# Altium schematic sheet 4_wiring drawing.SchDoc: DUT POWER ON/OFF CONTROL
size A2; ApprovedBy: Approved By; CheckedBy: Sky Ma; DrawnBy: Jack; Address1: 1; Address2: 2; Address3: 3; Address4: 4; DocumentNumber: 04-TE-42-4015-0PA-A; Revision: A; SheetNumber: 5; SheetTotal: 6; SheetSize: A2; CheckedByDate: 2022-11-19; DrawByDate: 2022-11-19; SiteName: EMS TD Huangpu; ProjectName: 19205_BMW CCU DDR PCBA FT fixture wiring
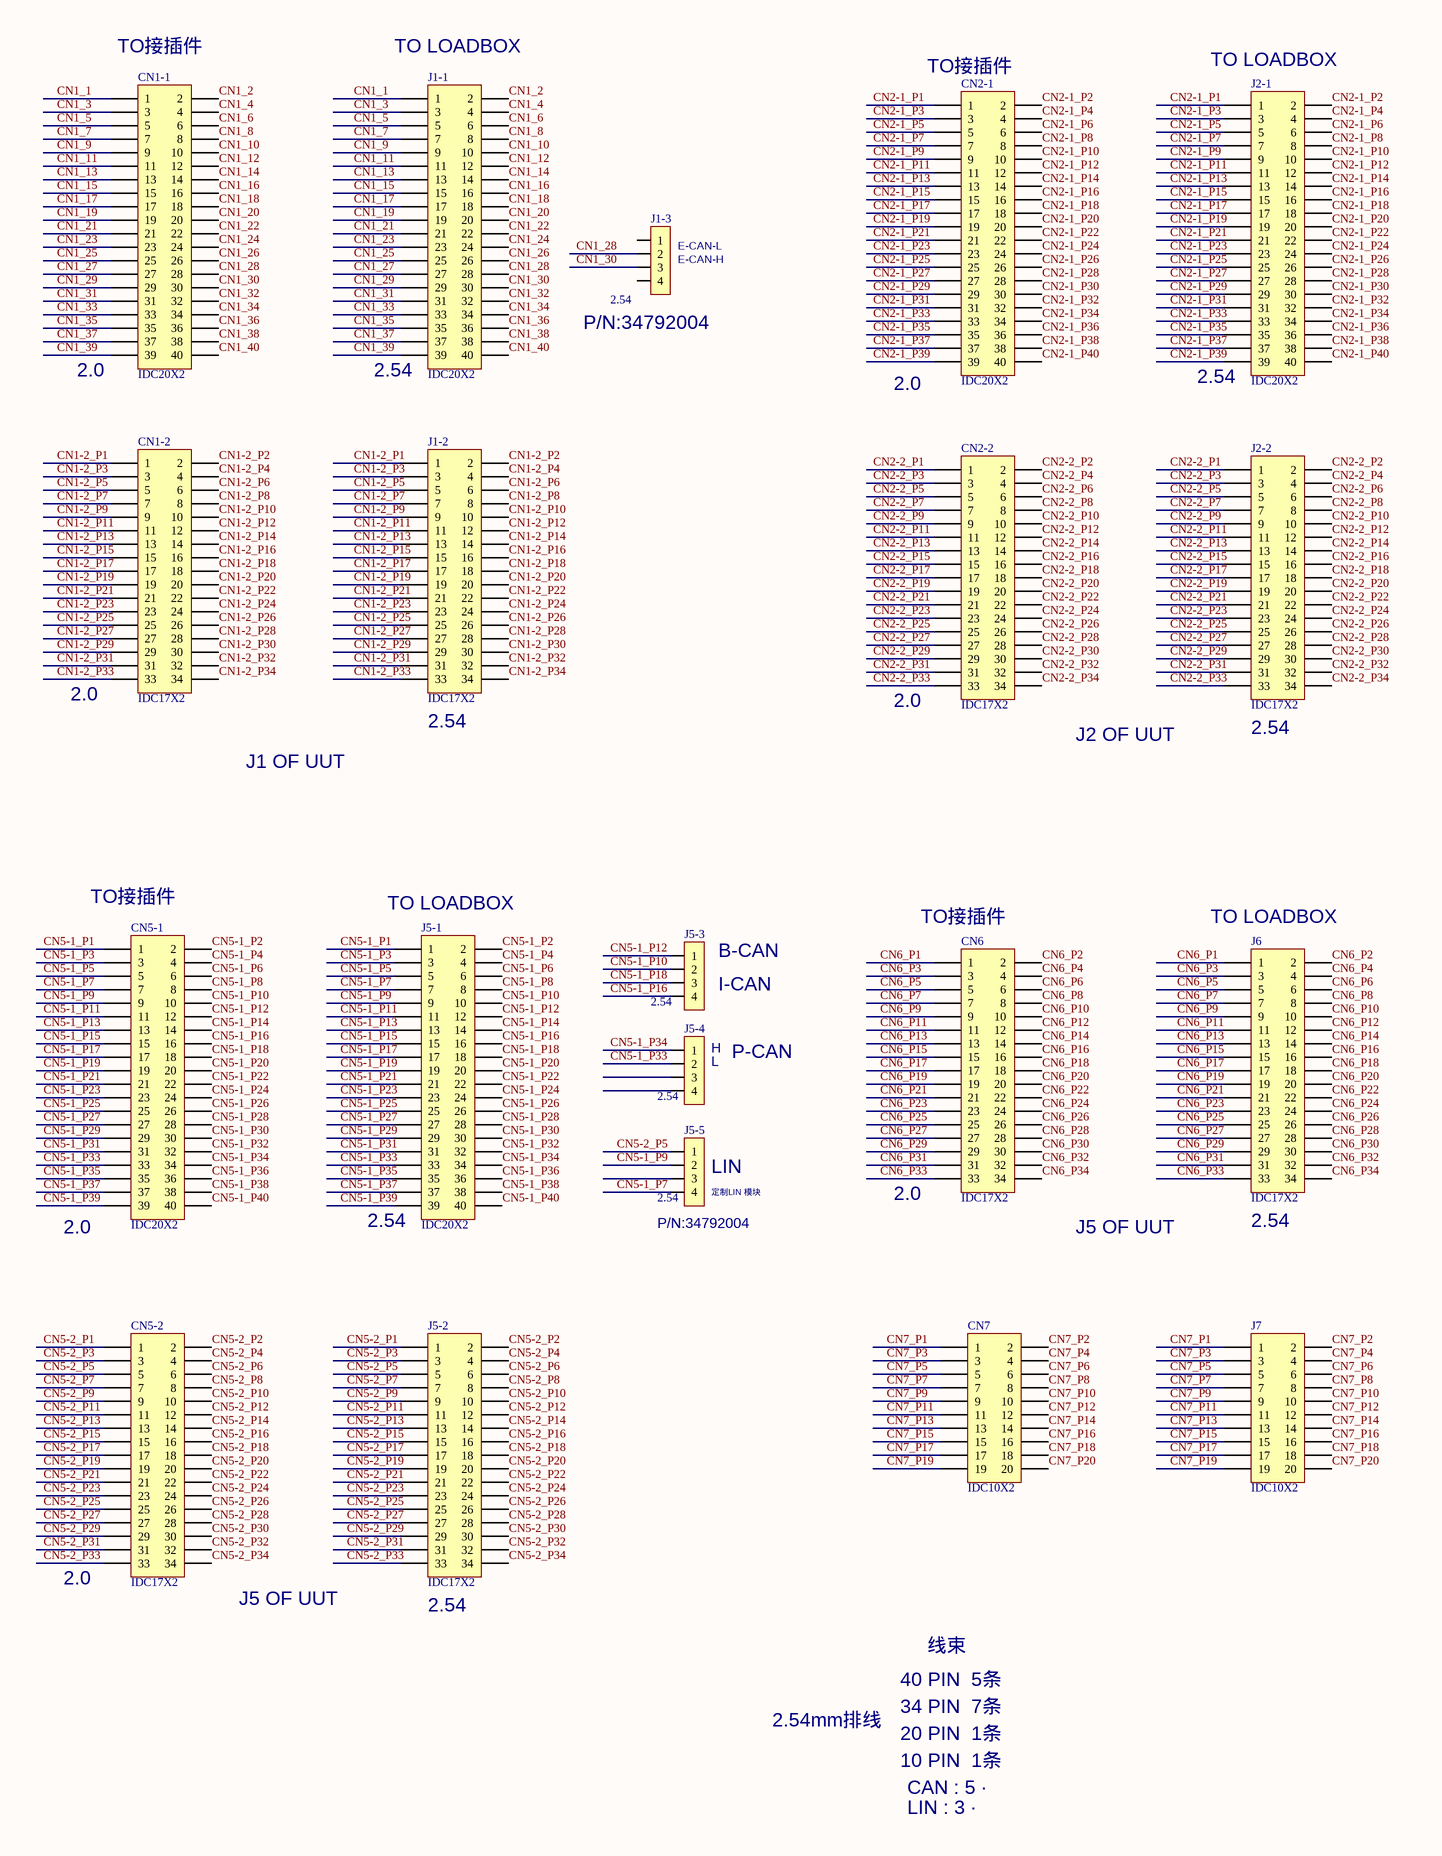
[diagram p0: 4_wiring drawing.SchDoc, left]
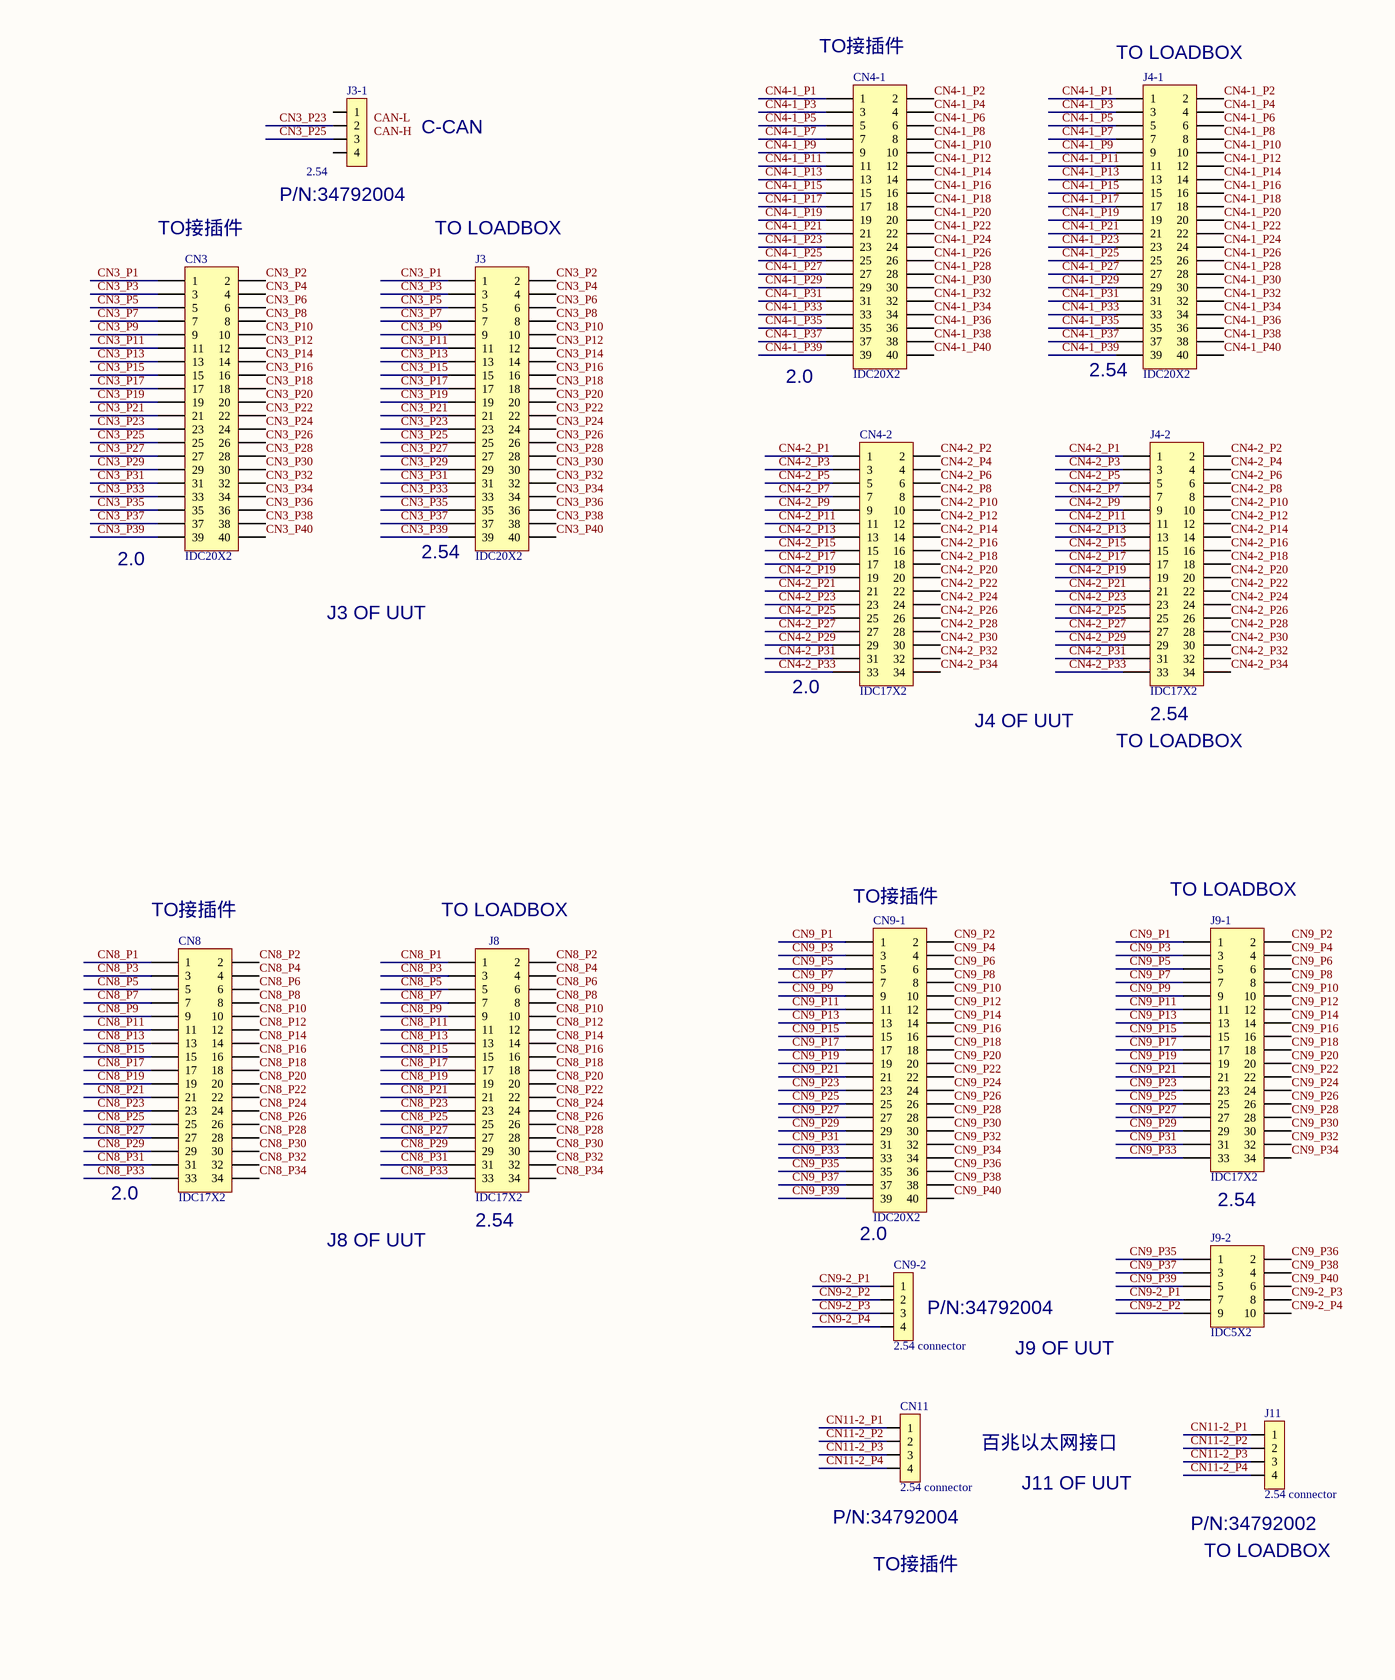
[diagram p1: 4_wiring drawing.SchDoc, right]

## Parts
CN1-1  IDC20X2  [IDC40]
CN1-2  IDC17X2  [IDC34]
CN2-1  IDC20X2  [IDC40]
CN2-2  IDC17X2  [IDC34]
CN3  IDC20X2  [IDC40]
CN4-1  IDC20X2  [IDC40]
CN4-2  IDC17X2  [IDC34]
CN5-1  IDC20X2  [IDC40]
CN5-2  IDC17X2  [IDC34]
CN6  IDC17X2  [IDC34]
CN7  IDC10X2  [IDC20]
CN8  IDC17X2  [IDC34]
CN9-1  IDC20X2  [IDC40]
CN9-2  2.54 connector  [2.54mm-4]
CN11  2.54 connector  [2.54mm-4]
J1-1  IDC20X2  [IDC40]
J1-2  IDC17X2  [IDC34]
J1-3  2.54  [2.54mm-4]
J2-1  IDC20X2  [IDC40]
J2-2  IDC17X2  [IDC34]
J3  IDC20X2  [IDC40]
J3-1  2.54  [2.54mm-4]
J4-1  IDC20X2  [IDC40]
J4-2  IDC17X2  [IDC34]
J5-1  IDC20X2  [IDC40]
J5-2  IDC17X2  [IDC34]
J5-3  2.54  [2.54mm-4]
J5-4  2.54  [2.54mm-4]
J5-5  2.54  [2.54mm-4]
J6  IDC17X2  [IDC34]
J7  IDC10X2  [IDC20]
J8  IDC17X2  [IDC34]
J9-1  IDC17X2  [IDC34]
J9-2  IDC5X2  [IDC10]
J11  2.54 connector  [2.54mm-4]

## Nets
CN1-2_P1: CN1-2.1 J1-2.1
CN1-2_P2: CN1-2.2 J1-2.2
CN1-2_P3: CN1-2.3 J1-2.3
CN1-2_P4: CN1-2.4 J1-2.4
CN1-2_P5: CN1-2.5 J1-2.5
CN1-2_P6: CN1-2.6 J1-2.6
CN1-2_P7: CN1-2.7 J1-2.7
CN1-2_P8: CN1-2.8 J1-2.8
CN1-2_P9: CN1-2.9 J1-2.9
CN1-2_P10: CN1-2.10 J1-2.10
CN1-2_P11: CN1-2.11 J1-2.11
CN1-2_P12: CN1-2.12 J1-2.12
CN1-2_P13: CN1-2.13 J1-2.13
CN1-2_P14: CN1-2.14 J1-2.14
CN1-2_P15: CN1-2.15 J1-2.15
CN1-2_P16: CN1-2.16 J1-2.16
CN1-2_P17: CN1-2.17 J1-2.17
CN1-2_P18: CN1-2.18 J1-2.18
CN1-2_P19: CN1-2.19 J1-2.19
CN1-2_P20: CN1-2.20 J1-2.20
CN1-2_P21: CN1-2.21 J1-2.21
CN1-2_P22: CN1-2.22 J1-2.22
CN1-2_P23: CN1-2.23 J1-2.23
CN1-2_P24: CN1-2.24 J1-2.24
CN1-2_P25: CN1-2.25 J1-2.25
CN1-2_P26: CN1-2.26 J1-2.26
CN1-2_P27: CN1-2.27 J1-2.27
CN1-2_P28: CN1-2.28 J1-2.28
CN1-2_P29: CN1-2.29 J1-2.29
CN1-2_P30: CN1-2.30 J1-2.30
CN1-2_P31: CN1-2.31 J1-2.31
CN1-2_P32: CN1-2.32 J1-2.32
CN1-2_P33: CN1-2.33 J1-2.33
CN1-2_P34: CN1-2.34 J1-2.34
CN1_1: CN1-1.1 J1-1.1
CN1_2: CN1-1.2 J1-1.2
CN1_3: CN1-1.3 J1-1.3
CN1_4: CN1-1.4 J1-1.4
CN1_5: CN1-1.5 J1-1.5
CN1_6: CN1-1.6 J1-1.6
CN1_7: CN1-1.7 J1-1.7
CN1_8: CN1-1.8 J1-1.8
CN1_9: CN1-1.9 J1-1.9
CN1_10: CN1-1.10 J1-1.10
CN1_11: CN1-1.11 J1-1.11
CN1_12: CN1-1.12 J1-1.12
CN1_13: CN1-1.13 J1-1.13
CN1_14: CN1-1.14 J1-1.14
CN1_15: CN1-1.15 J1-1.15
CN1_16: CN1-1.16 J1-1.16
CN1_17: CN1-1.17 J1-1.17
CN1_18: CN1-1.18 J1-1.18
CN1_19: CN1-1.19 J1-1.19
CN1_20: CN1-1.20 J1-1.20
CN1_21: CN1-1.21 J1-1.21
CN1_22: CN1-1.22 J1-1.22
CN1_23: CN1-1.23 J1-1.23
CN1_24: CN1-1.24 J1-1.24
CN1_25: CN1-1.25 J1-1.25
CN1_26: CN1-1.26 J1-1.26
CN1_27: CN1-1.27 J1-1.27
CN1_28: CN1-1.28 J1-1.28 J1-3.2
CN1_29: CN1-1.29 J1-1.29
CN1_30: CN1-1.30 J1-1.30 J1-3.3
CN1_31: CN1-1.31 J1-1.31
CN1_32: CN1-1.32 J1-1.32
CN1_33: CN1-1.33 J1-1.33
CN1_34: CN1-1.34 J1-1.34
CN1_35: CN1-1.35 J1-1.35
CN1_36: CN1-1.36 J1-1.36
CN1_37: CN1-1.37 J1-1.37
CN1_38: CN1-1.38 J1-1.38
CN1_39: CN1-1.39 J1-1.39
CN1_40: CN1-1.40 J1-1.40
CN2-1_P1: CN2-1.1 J2-1.1
CN2-1_P2: CN2-1.2 J2-1.2
CN2-1_P3: CN2-1.3 J2-1.3
CN2-1_P4: CN2-1.4 J2-1.4
CN2-1_P5: CN2-1.5 J2-1.5
CN2-1_P6: CN2-1.6 J2-1.6
CN2-1_P7: CN2-1.7 J2-1.7
CN2-1_P8: CN2-1.8 J2-1.8
CN2-1_P9: CN2-1.9 J2-1.9
CN2-1_P10: CN2-1.10 J2-1.10
CN2-1_P11: CN2-1.11 J2-1.11
CN2-1_P12: CN2-1.12 J2-1.12
CN2-1_P13: CN2-1.13 J2-1.13
CN2-1_P14: CN2-1.14 J2-1.14
CN2-1_P15: CN2-1.15 J2-1.15
CN2-1_P16: CN2-1.16 J2-1.16
CN2-1_P17: CN2-1.17 J2-1.17
CN2-1_P18: CN2-1.18 J2-1.18
CN2-1_P19: CN2-1.19 J2-1.19
CN2-1_P20: CN2-1.20 J2-1.20
CN2-1_P21: CN2-1.21 J2-1.21
CN2-1_P22: CN2-1.22 J2-1.22
CN2-1_P23: CN2-1.23 J2-1.23
CN2-1_P24: CN2-1.24 J2-1.24
CN2-1_P25: CN2-1.25 J2-1.25
CN2-1_P26: CN2-1.26 J2-1.26
CN2-1_P27: CN2-1.27 J2-1.27
CN2-1_P28: CN2-1.28 J2-1.28
CN2-1_P29: CN2-1.29 J2-1.29
CN2-1_P30: CN2-1.30 J2-1.30
CN2-1_P31: CN2-1.31 J2-1.31
CN2-1_P32: CN2-1.32 J2-1.32
CN2-1_P33: CN2-1.33 J2-1.33
CN2-1_P34: CN2-1.34 J2-1.34
CN2-1_P35: CN2-1.35 J2-1.35
CN2-1_P36: CN2-1.36 J2-1.36
CN2-1_P37: CN2-1.37 J2-1.37
CN2-1_P38: CN2-1.38 J2-1.38
CN2-1_P39: CN2-1.39 J2-1.39
CN2-1_P40: CN2-1.40 J2-1.40
CN2-2_P1: CN2-2.1 J2-2.1
CN2-2_P2: CN2-2.2 J2-2.2
CN2-2_P3: CN2-2.3 J2-2.3
CN2-2_P4: CN2-2.4 J2-2.4
CN2-2_P5: CN2-2.5 J2-2.5
CN2-2_P6: CN2-2.6 J2-2.6
CN2-2_P7: CN2-2.7 J2-2.7
CN2-2_P8: CN2-2.8 J2-2.8
CN2-2_P9: CN2-2.9 J2-2.9
CN2-2_P10: CN2-2.10 J2-2.10
CN2-2_P11: CN2-2.11 J2-2.11
CN2-2_P12: CN2-2.12 J2-2.12
CN2-2_P13: CN2-2.13 J2-2.13
CN2-2_P14: CN2-2.14 J2-2.14
CN2-2_P15: CN2-2.15 J2-2.15
CN2-2_P16: CN2-2.16 J2-2.16
CN2-2_P17: CN2-2.17 J2-2.17
CN2-2_P18: CN2-2.18 J2-2.18
CN2-2_P19: CN2-2.19 J2-2.19
CN2-2_P20: CN2-2.20 J2-2.20
CN2-2_P21: CN2-2.21 J2-2.21
CN2-2_P22: CN2-2.22 J2-2.22
CN2-2_P23: CN2-2.23 J2-2.23
CN2-2_P24: CN2-2.24 J2-2.24
CN2-2_P25: CN2-2.25 J2-2.25
CN2-2_P26: CN2-2.26 J2-2.26
CN2-2_P27: CN2-2.27 J2-2.27
CN2-2_P28: CN2-2.28 J2-2.28
CN2-2_P29: CN2-2.29 J2-2.29
CN2-2_P30: CN2-2.30 J2-2.30
CN2-2_P31: CN2-2.31 J2-2.31
CN2-2_P32: CN2-2.32 J2-2.32
CN2-2_P33: CN2-2.33 J2-2.33
CN2-2_P34: CN2-2.34 J2-2.34
CN3_P1: CN3.1 J3.1
CN3_P2: CN3.2 J3.2
CN3_P3: CN3.3 J3.3
CN3_P4: CN3.4 J3.4
CN3_P5: CN3.5 J3.5
CN3_P6: CN3.6 J3.6
CN3_P7: CN3.7 J3.7
CN3_P8: CN3.8 J3.8
CN3_P9: CN3.9 J3.9
CN3_P10: CN3.10 J3.10
CN3_P11: CN3.11 J3.11
CN3_P12: CN3.12 J3.12
CN3_P13: CN3.13 J3.13
CN3_P14: CN3.14 J3.14
CN3_P15: CN3.15 J3.15
CN3_P16: CN3.16 J3.16
CN3_P17: CN3.17 J3.17
CN3_P18: CN3.18 J3.18
CN3_P19: CN3.19 J3.19
CN3_P20: CN3.20 J3.20
CN3_P21: CN3.21 J3.21
CN3_P22: CN3.22 J3.22
CN3_P23: CN3.23 J3.23 J3-1.2
CN3_P24: CN3.24 J3.24
CN3_P25: CN3.25 J3.25 J3-1.3
CN3_P26: CN3.26 J3.26
CN3_P27: CN3.27 J3.27
CN3_P28: CN3.28 J3.28
CN3_P29: CN3.29 J3.29
CN3_P30: CN3.30 J3.30
CN3_P31: CN3.31 J3.31
CN3_P32: CN3.32 J3.32
CN3_P33: CN3.33 J3.33
CN3_P34: CN3.34 J3.34
CN3_P35: CN3.35 J3.35
CN3_P36: CN3.36 J3.36
CN3_P37: CN3.37 J3.37
CN3_P38: CN3.38 J3.38
CN3_P39: CN3.39 J3.39
CN3_P40: CN3.40 J3.40
CN4-1_P1: CN4-1.1 J4-1.1
CN4-1_P2: CN4-1.2 J4-1.2
CN4-1_P3: CN4-1.3 J4-1.3
CN4-1_P4: CN4-1.4 J4-1.4
CN4-1_P5: CN4-1.5 J4-1.5
CN4-1_P6: CN4-1.6 J4-1.6
CN4-1_P7: CN4-1.7 J4-1.7
CN4-1_P8: CN4-1.8 J4-1.8
CN4-1_P9: CN4-1.9 J4-1.9
CN4-1_P10: CN4-1.10 J4-1.10
CN4-1_P11: CN4-1.11 J4-1.11
CN4-1_P12: CN4-1.12 J4-1.12
CN4-1_P13: CN4-1.13 J4-1.13
CN4-1_P14: CN4-1.14 J4-1.14
CN4-1_P15: CN4-1.15 J4-1.15
CN4-1_P16: CN4-1.16 J4-1.16
CN4-1_P17: CN4-1.17 J4-1.17
CN4-1_P18: CN4-1.18 J4-1.18
CN4-1_P19: CN4-1.19 J4-1.19
CN4-1_P20: CN4-1.20 J4-1.20
CN4-1_P21: CN4-1.21 J4-1.21
CN4-1_P22: CN4-1.22 J4-1.22
CN4-1_P23: CN4-1.23 J4-1.23
CN4-1_P24: CN4-1.24 J4-1.24
CN4-1_P25: CN4-1.25 J4-1.25
CN4-1_P26: CN4-1.26 J4-1.26
CN4-1_P27: CN4-1.27 J4-1.27
CN4-1_P28: CN4-1.28 J4-1.28
CN4-1_P29: CN4-1.29 J4-1.29
CN4-1_P30: CN4-1.30 J4-1.30
CN4-1_P31: CN4-1.31 J4-1.31
CN4-1_P32: CN4-1.32 J4-1.32
CN4-1_P33: CN4-1.33 J4-1.33
CN4-1_P34: CN4-1.34 J4-1.34
CN4-1_P35: CN4-1.35 J4-1.35
CN4-1_P36: CN4-1.36 J4-1.36
CN4-1_P37: CN4-1.37 J4-1.37
CN4-1_P38: CN4-1.38 J4-1.38
CN4-1_P39: CN4-1.39 J4-1.39
CN4-1_P40: CN4-1.40 J4-1.40
CN4-2_P1: CN4-2.1 J4-2.1
CN4-2_P2: CN4-2.2 J4-2.2
CN4-2_P3: CN4-2.3 J4-2.3
CN4-2_P4: CN4-2.4 J4-2.4
CN4-2_P5: CN4-2.5 J4-2.5
CN4-2_P6: CN4-2.6 J4-2.6
CN4-2_P7: CN4-2.7 J4-2.7
CN4-2_P8: CN4-2.8 J4-2.8
CN4-2_P9: CN4-2.9 J4-2.9
CN4-2_P10: CN4-2.10 J4-2.10
CN4-2_P11: CN4-2.11 J4-2.11
CN4-2_P12: CN4-2.12 J4-2.12
CN4-2_P13: CN4-2.13 J4-2.13
CN4-2_P14: CN4-2.14 J4-2.14
CN4-2_P15: CN4-2.15 J4-2.15
CN4-2_P16: CN4-2.16 J4-2.16
CN4-2_P17: CN4-2.17 J4-2.17
CN4-2_P18: CN4-2.18 J4-2.18
CN4-2_P19: CN4-2.19 J4-2.19
CN4-2_P20: CN4-2.20 J4-2.20
CN4-2_P21: CN4-2.21 J4-2.21
CN4-2_P22: CN4-2.22 J4-2.22
CN4-2_P23: CN4-2.23 J4-2.23
CN4-2_P24: CN4-2.24 J4-2.24
CN4-2_P25: CN4-2.25 J4-2.25
CN4-2_P26: CN4-2.26 J4-2.26
CN4-2_P27: CN4-2.27 J4-2.27
CN4-2_P28: CN4-2.28 J4-2.28
CN4-2_P29: CN4-2.29 J4-2.29
CN4-2_P30: CN4-2.30 J4-2.30
CN4-2_P31: CN4-2.31 J4-2.31
CN4-2_P32: CN4-2.32 J4-2.32
CN4-2_P33: CN4-2.33 J4-2.33
CN4-2_P34: CN4-2.34 J4-2.34
CN5-1_P1: CN5-1.1 J5-1.1
CN5-1_P2: CN5-1.2 J5-1.2
CN5-1_P3: CN5-1.3 J5-1.3
CN5-1_P4: CN5-1.4 J5-1.4
CN5-1_P5: CN5-1.5 J5-1.5
CN5-1_P6: CN5-1.6 J5-1.6
CN5-1_P7: CN5-1.7 J5-1.7 J5-5.4
CN5-1_P8: CN5-1.8 J5-1.8
CN5-1_P9: CN5-1.9 J5-1.9 J5-5.2
CN5-1_P10: CN5-1.10 J5-1.10 J5-3.2
CN5-1_P11: CN5-1.11 J5-1.11
CN5-1_P12: CN5-1.12 J5-1.12 J5-3.1
CN5-1_P13: CN5-1.13 J5-1.13
CN5-1_P14: CN5-1.14 J5-1.14
CN5-1_P15: CN5-1.15 J5-1.15
CN5-1_P16: CN5-1.16 J5-1.16 J5-3.4
CN5-1_P17: CN5-1.17 J5-1.17
CN5-1_P18: CN5-1.18 J5-1.18 J5-3.3
CN5-1_P19: CN5-1.19 J5-1.19
CN5-1_P20: CN5-1.20 J5-1.20
CN5-1_P21: CN5-1.21 J5-1.21
CN5-1_P22: CN5-1.22 J5-1.22
CN5-1_P23: CN5-1.23 J5-1.23
CN5-1_P24: CN5-1.24 J5-1.24
CN5-1_P25: CN5-1.25 J5-1.25
CN5-1_P26: CN5-1.26 J5-1.26
CN5-1_P27: CN5-1.27 J5-1.27
CN5-1_P28: CN5-1.28 J5-1.28
CN5-1_P29: CN5-1.29 J5-1.29
CN5-1_P30: CN5-1.30 J5-1.30
CN5-1_P31: CN5-1.31 J5-1.31
CN5-1_P32: CN5-1.32 J5-1.32
CN5-1_P33: CN5-1.33 J5-1.33 J5-4.2
CN5-1_P34: CN5-1.34 J5-1.34 J5-4.1
CN5-1_P35: CN5-1.35 J5-1.35
CN5-1_P36: CN5-1.36 J5-1.36
CN5-1_P37: CN5-1.37 J5-1.37
CN5-1_P38: CN5-1.38 J5-1.38
CN5-1_P39: CN5-1.39 J5-1.39
CN5-1_P40: CN5-1.40 J5-1.40
CN5-2_P1: CN5-2.1 J5-2.1
CN5-2_P2: CN5-2.2 J5-2.2
CN5-2_P3: CN5-2.3 J5-2.3
CN5-2_P4: CN5-2.4 J5-2.4
CN5-2_P5: CN5-2.5 J5-2.5 J5-5.1
CN5-2_P6: CN5-2.6 J5-2.6
CN5-2_P7: CN5-2.7 J5-2.7
CN5-2_P8: CN5-2.8 J5-2.8
CN5-2_P9: CN5-2.9 J5-2.9
CN5-2_P10: CN5-2.10 J5-2.10
CN5-2_P11: CN5-2.11 J5-2.11
CN5-2_P12: CN5-2.12 J5-2.12
CN5-2_P13: CN5-2.13 J5-2.13
CN5-2_P14: CN5-2.14 J5-2.14
CN5-2_P15: CN5-2.15 J5-2.15
CN5-2_P16: CN5-2.16 J5-2.16
CN5-2_P17: CN5-2.17 J5-2.17
CN5-2_P18: CN5-2.18 J5-2.18
CN5-2_P19: CN5-2.19 J5-2.19
CN5-2_P20: CN5-2.20 J5-2.20
CN5-2_P21: CN5-2.21 J5-2.21
CN5-2_P22: CN5-2.22 J5-2.22
CN5-2_P23: CN5-2.23 J5-2.23
CN5-2_P24: CN5-2.24 J5-2.24
CN5-2_P25: CN5-2.25 J5-2.25
CN5-2_P26: CN5-2.26 J5-2.26
CN5-2_P27: CN5-2.27 J5-2.27
CN5-2_P28: CN5-2.28 J5-2.28
CN5-2_P29: CN5-2.29 J5-2.29
CN5-2_P30: CN5-2.30 J5-2.30
CN5-2_P31: CN5-2.31 J5-2.31
CN5-2_P32: CN5-2.32 J5-2.32
CN5-2_P33: CN5-2.33 J5-2.33
CN5-2_P34: CN5-2.34 J5-2.34
CN6_P1: CN6.1 J6.1
CN6_P2: CN6.2 J6.2
CN6_P3: CN6.3 J6.3
CN6_P4: CN6.4 J6.4
CN6_P5: CN6.5 J6.5
CN6_P6: CN6.6 J6.6
CN6_P7: CN6.7 J6.7
CN6_P8: CN6.8 J6.8
CN6_P9: CN6.9 J6.9
CN6_P10: CN6.10 J6.10
CN6_P11: CN6.11 J6.11
CN6_P12: CN6.12 J6.12
CN6_P13: CN6.13 J6.13
CN6_P14: CN6.14 J6.14
CN6_P15: CN6.15 J6.15
CN6_P16: CN6.16 J6.16
CN6_P17: CN6.17 J6.17
CN6_P18: CN6.18 J6.18
CN6_P19: CN6.19 J6.19
CN6_P20: CN6.20 J6.20
CN6_P21: CN6.21 J6.21
CN6_P22: CN6.22 J6.22
CN6_P23: CN6.23 J6.23
CN6_P24: CN6.24 J6.24
CN6_P25: CN6.25 J6.25
CN6_P26: CN6.26 J6.26
CN6_P27: CN6.27 J6.27
CN6_P28: CN6.28 J6.28
CN6_P29: CN6.29 J6.29
CN6_P30: CN6.30 J6.30
CN6_P31: CN6.31 J6.31
CN6_P32: CN6.32 J6.32
CN6_P33: CN6.33 J6.33
CN6_P34: CN6.34 J6.34
CN7_P1: CN7.1 J7.1
CN7_P2: CN7.2 J7.2
CN7_P3: CN7.3 J7.3
CN7_P4: CN7.4 J7.4
CN7_P5: CN7.5 J7.5
CN7_P6: CN7.6 J7.6
CN7_P7: CN7.7 J7.7
CN7_P8: CN7.8 J7.8
CN7_P9: CN7.9 J7.9
CN7_P10: CN7.10 J7.10
CN7_P11: CN7.11 J7.11
CN7_P12: CN7.12 J7.12
CN7_P13: CN7.13 J7.13
CN7_P14: CN7.14 J7.14
CN7_P15: CN7.15 J7.15
CN7_P16: CN7.16 J7.16
CN7_P17: CN7.17 J7.17
CN7_P18: CN7.18 J7.18
CN7_P19: CN7.19 J7.19
CN7_P20: CN7.20 J7.20
CN8_P1: CN8.1 J8.1
CN8_P2: CN8.2 J8.2
CN8_P3: CN8.3 J8.3
CN8_P4: CN8.4 J8.4
CN8_P5: CN8.5 J8.5
CN8_P6: CN8.6 J8.6
CN8_P7: CN8.7 J8.7
CN8_P8: CN8.8 J8.8
CN8_P9: CN8.9 J8.9
CN8_P10: CN8.10 J8.10
CN8_P11: CN8.11 J8.11
CN8_P12: CN8.12 J8.12
CN8_P13: CN8.13 J8.13
CN8_P14: CN8.14 J8.14
CN8_P15: CN8.15 J8.15
CN8_P16: CN8.16 J8.16
CN8_P17: CN8.17 J8.17
CN8_P18: CN8.18 J8.18
CN8_P19: CN8.19 J8.19
CN8_P20: CN8.20 J8.20
CN8_P21: CN8.21 J8.21
CN8_P22: CN8.22 J8.22
CN8_P23: CN8.23 J8.23
CN8_P24: CN8.24 J8.24
CN8_P25: CN8.25 J8.25
CN8_P26: CN8.26 J8.26
CN8_P27: CN8.27 J8.27
CN8_P28: CN8.28 J8.28
CN8_P29: CN8.29 J8.29
CN8_P30: CN8.30 J8.30
CN8_P31: CN8.31 J8.31
CN8_P32: CN8.32 J8.32
CN8_P33: CN8.33 J8.33
CN8_P34: CN8.34 J8.34
CN9-2_P1: CN9-2.1 J9-2.7
CN9-2_P2: CN9-2.2 J9-2.9
CN9-2_P3: CN9-2.3 J9-2.8
CN9-2_P4: CN9-2.4 J9-2.10
CN9_P1: CN9-1.1 J9-1.1
CN9_P2: CN9-1.2 J9-1.2
CN9_P3: CN9-1.3 J9-1.3
CN9_P4: CN9-1.4 J9-1.4
CN9_P5: CN9-1.5 J9-1.5
CN9_P6: CN9-1.6 J9-1.6
CN9_P7: CN9-1.7 J9-1.7
CN9_P8: CN9-1.8 J9-1.8
CN9_P9: CN9-1.9 J9-1.9
CN9_P10: CN9-1.10 J9-1.10
CN9_P11: CN9-1.11 J9-1.11
CN9_P12: CN9-1.12 J9-1.12
CN9_P13: CN9-1.13 J9-1.13
CN9_P14: CN9-1.14 J9-1.14
CN9_P15: CN9-1.15 J9-1.15
CN9_P16: CN9-1.16 J9-1.16
CN9_P17: CN9-1.17 J9-1.17
CN9_P18: CN9-1.18 J9-1.18
CN9_P19: CN9-1.19 J9-1.19
CN9_P20: CN9-1.20 J9-1.20
CN9_P21: CN9-1.21 J9-1.21
CN9_P22: CN9-1.22 J9-1.22
CN9_P23: CN9-1.23 J9-1.23
CN9_P24: CN9-1.24 J9-1.24
CN9_P25: CN9-1.25 J9-1.25
CN9_P26: CN9-1.26 J9-1.26
CN9_P27: CN9-1.27 J9-1.27
CN9_P28: CN9-1.28 J9-1.28
CN9_P29: CN9-1.29 J9-1.29
CN9_P30: CN9-1.30 J9-1.30
CN9_P31: CN9-1.31 J9-1.31
CN9_P32: CN9-1.32 J9-1.32
CN9_P33: CN9-1.33 J9-1.33
CN9_P34: CN9-1.34 J9-1.34
CN9_P35: CN9-1.35 J9-2.1
CN9_P36: CN9-1.36 J9-2.2
CN9_P37: CN9-1.37 J9-2.3
CN9_P38: CN9-1.38 J9-2.4
CN9_P39: CN9-1.39 J9-2.5
CN9_P40: CN9-1.40 J9-2.6
CN11-2_P1: CN11.1 J11.1
CN11-2_P2: CN11.2 J11.2
CN11-2_P3: CN11.3 J11.3
CN11-2_P4: CN11.4 J11.4

Not connected (* = marked no-connect by the designer): J1-3 1 4; J3-1 1 4; J5-4 3 4; J5-5 3

## Notes on the sheet
- (near CN1-1) TO接插件
- (near J1-1) TO LOADBOX
- (near CN2-1) TO接插件
- (near J2-1) TO LOADBOX
- (near CN4-1) TO接插件
- (near J4-1) TO LOADBOX
- C-CAN
- (near CN3) TO接插件
- (near J3-1) P/N:34792004
- (near J3) TO LOADBOX
- (near J1-3) E-CAN-H
- (near J1-3) E-CAN-L
- (near J1-3) P/N:34792004
- (near CN1-1) 2.0
- (near J1-1) 2.54
- (near CN2-1) 2.0
- (near J2-1) 2.54
- (near CN4-1) 2.0
- (near J4-1) 2.54
- (near CN3) 2.0
- (near J3) 2.54
- J3 OF UUT
- (near CN1-2) 2.0
- (near CN2-2) 2.0
- (near CN4-2) 2.0
- J1 OF UUT
- (near J1-2) 2.54
- J2 OF UUT
- (near J2-2) 2.54
- J4 OF UUT
- TO LOADBOX
- (near J4-2) 2.54
- (near CN5-1) TO接插件
- (near J5-1) TO LOADBOX
- (near CN9-1) TO接插件
- (near J9-1) TO LOADBOX
- (near J5-3) B-CAN
- (near CN6) TO接插件
- (near J6) TO LOADBOX
- (near CN8) TO接插件
- (near J8) TO LOADBOX
- (near J5-3) I-CAN
- (near J5-4) H
- (near J5-4) L
- P-CAN
- (near J5-5) LIN
- (near CN5-1) 2.0
- (near J5-1) 2.54
- (near J5-5) P/N:34792004
- (near J5-5) 定制LIN 模块
- (near CN6) 2.0
- J5 OF UUT
- (near J6) 2.54
- (near CN8) 2.0
- J8 OF UUT
- (near J8) 2.54
- 2.0
- 2.54
- (near CN9-2) P/N:34792004
- J9 OF UUT
- 百兆以太网接口
- (near CN11) P/N:34792004
- J11 OF UUT
- (near CN5-2) 2.0
- TO接插件
- (near J11) P/N:34792002
- (near J5-2) 2.54
- 线束
- 40 PIN  5条
- 34 PIN  7条
- 2.54mm排线
- 20 PIN  1条
- 10 PIN  1条
- CAN : 5 ·
- LIN : 3 ·
- Labels drawn without touching a wire or pin: CAN-H, CAN-L
- Document Number:
- Rev:
- Project Name:
- Drawn By:
- Date:
- Titile:
- Checked By:
- Sheet:
- Of

## Library data of the parts
CN9-2 CN11 J1-3 J3-1 J5-3-J5-5 J11 = CON4-2.54